# Altium schematic sheet Sheet1.SchDoc
size A; Author: Michael Chen; CompanyName: Pi-ooners; DrawnBy: Michael Chen; Engineer: Michael Chen; Organization: Pi-ooners; SheetNumber: 1; SheetTotal: 1
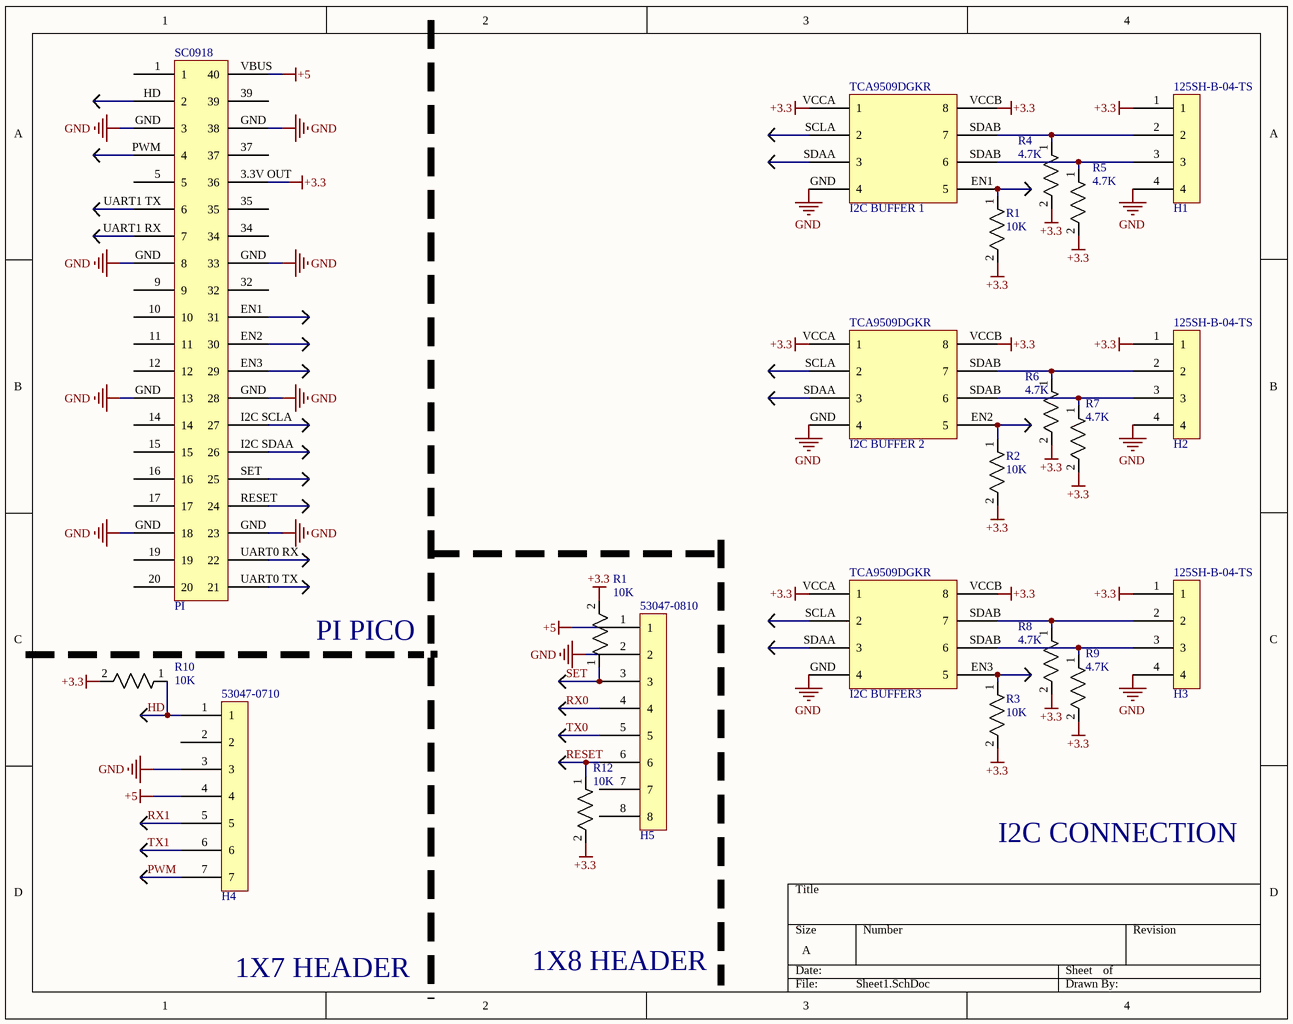
[diagram p0: Sheet1.SchDoc]

## Parts
(Parts that share a designator on the sheet are numbered #1, #2 ... from top to bottom, then left to right.)
125SH-B-04-TS#1  H1
125SH-B-04-TS#2  H2
125SH-B-04-TS#3  H3
53047-0710  H4
53047-0810  H5
R1#1  10K  [RES_CRCW_0603]
R1#2  10K  [RES_CRCW_0603]
R2  10K  [RES_CRCW_0603]
R3  10K  [RES_CRCW_0603]
R4  4.7K
R5  4.7K
R6  4.7K
R7  4.7K
R8  4.7K
R9  4.7K
R10  10K  [RES_CRCW_0603]
R12  10K  [RES_CRCW_0603]
SC0918  PI
TCA9509DGKR#1  I2C BUFFER 1
TCA9509DGKR#2  I2C BUFFER 2
TCA9509DGKR#3  I2C BUFFER3

## Nets
+3.3: 125SH-B-04-TS#1.1 125SH-B-04-TS#2.1 125SH-B-04-TS#3.1 R1#1.2 R1#2.2 R2.2 R3.2 R4.2 R5.2 R6.2 R7.2 R8.2 R9.2 R10.2 R12.2 SC0918.3.3V_OUT(36) TCA9509DGKR#1.VCCA(1) TCA9509DGKR#1.VCCB(8) TCA9509DGKR#2.VCCA(1) TCA9509DGKR#2.VCCB(8) TCA9509DGKR#3.VCCA(1) TCA9509DGKR#3.VCCB(8)
+5: 53047-0710.4 53047-0810.1 SC0918.VBUS(40)
GND: 125SH-B-04-TS#1.4 125SH-B-04-TS#2.4 125SH-B-04-TS#3.4 53047-0710.3 53047-0810.2 SC0918.GND(3) TCA9509DGKR#1.GND(4) TCA9509DGKR#2.GND(4) TCA9509DGKR#3.GND(4)
HD: 53047-0710.1 R10.1
PWM: 53047-0710.7
RESET: 53047-0810.6 R12.1
RX0: 53047-0810.4
RX1: 53047-0710.5
SET: 53047-0810.3 R1#2.1
TX0: 53047-0810.5
TX1: 53047-0710.6
Net125SH-B-04-TS#1_2: 125SH-B-04-TS#1.2 R4.1 TCA9509DGKR#1.SDAB(7)
Net125SH-B-04-TS#1_3: 125SH-B-04-TS#1.3 R5.1 TCA9509DGKR#1.SDAB(6)
Net125SH-B-04-TS#2_2: 125SH-B-04-TS#2.2 R6.1 TCA9509DGKR#2.SDAB(7)
Net125SH-B-04-TS#2_3: 125SH-B-04-TS#2.3 R7.1 TCA9509DGKR#2.SDAB(6)
Net125SH-B-04-TS#3_2: 125SH-B-04-TS#3.2 R8.1 TCA9509DGKR#3.SDAB(7)
Net125SH-B-04-TS#3_3: 125SH-B-04-TS#3.3 R9.1 TCA9509DGKR#3.SDAB(6)
NetR1#1_1: R1#1.1 TCA9509DGKR#1.EN(5)
NetR2_1: R2.1 TCA9509DGKR#2.EN(5)
NetR3_1: R3.1 TCA9509DGKR#3.EN(5)

Not connected (* = marked no-connect by the designer): 53047-0710 2; 53047-0810 7 8; SC0918 1 5 9 10 11 12 14 15 16 17 19 20 32 34 35 37 39 EN1(31) EN2(30) EN3(29) HD(2) I2C SCLA(27) I2C SDAA(26) PWM(4) RESET(24) SET(25) UART0 RX(22) UART0 TX(21) UART1 RX(7) UART1 TX(6); TCA9509DGKR#1 SCLA(2) SDAA(3); TCA9509DGKR#2 SCLA(2) SDAA(3); TCA9509DGKR#3 SCLA(2) SDAA(3)

## Notes on the sheet
- EN1
- (near TCA9509DGKR#2) EN2
- PI PICO
- EN3
- I2C CONNECTION
- 1X8 HEADER
- 1X7 HEADER

## Library data of the parts
125SH-B-04-TS#1-125SH-B-04-TS#3 = 1X4: Conn Shrouded Header (4 Sides) PL 4 POS 1.25mm Solder ST Top Entry Thru-Hole; Manufacturer: Adam Equipment; Manufacturer Part Number: 125SH-B-04-TS; Supplier: Digikey; Supplier Part Number: 2057-125SH-B-04-TS-ND; RoHS: No; Category: Connectors; Stock: 2581; ComponentLink1URL: http://datasheet.octopart.com/125SH-B-04-TS-Adam-Tech-datasheet-110600541.pdf?src-supplier=Digikey; ComponentLink1Description: http://datasheet.octopart.com/125SH-B-04-TS-Adam-Tech-datasheet-110600541.pdf?src-supplier=Digikey; ComponentLink2URL: http://datasheet.octopart.com/125SH-B-04-TS-Adam-Tech-datasheet-110600541.pdf?src-supplier=Allied+Electronics; ComponentLink2Description: http://datasheet.octopart.com/125SH-B-04-TS-Adam-Tech-datasheet-110600541.pdf?src-supplier=Allied+Electronics; ComponentLink3URL: http://datasheet.octopart.com/125SH-B-04-TS-Adam-Tech-datasheet-110600541.pdf?src-supplier=Arrow+Electronics; ComponentLink3Description: http://datasheet.octopart.com/125SH-B-04-TS-Adam-Tech-datasheet-110600541.pdf?src-supplier=Arrow+Electronics; ComponentLink4URL: http://datasheet.octopart.com/125SH-B-04-TS-Adam-Tech-datasheet-110600541.pdf?src-supplier=Verical; ComponentLink4Description: http://datasheet.octopart.com/125SH-B-04-TS-Adam-Tech-datasheet-110600541.pdf?src-supplier=Verical; ComponentLink5URL: http://datasheet.octopart.com/125SH-B-04-TS-Adam-Tech-datasheet-110600541.pdf?src-supplier=TME; ComponentLink5Description: http://datasheet.octopart.com/125SH-B-04-TS-Adam-Tech-datasheet-110600541.pdf?src-supplier=TME
53047-0710 = 1X7: Board Connector, 7 Contact(s), 1 Row(s), Male, Straight, 0.049 inch Pitch, Solder Terminal, Locking, White Insulator, Receptacle; Manufacturer: Molex; Manufacturer Part Number: 53047-0710; Manufacturer Series: 53047; Option: General Purpose; Contact Pattern: RECTANGULAR; Contact Style: Blade Pin; Filter Feature: No; Mating Information: MULTIPLE MATING PARTS AVAILABLE; Number Of Connectors: 1; Polarization Key: POLARIZED HOUSING; Number of Contacts: 7; Body Breadth: 0.126inch; Body Depth: 0.165inch; Body Length: 0.413inch; Reference Standard: UL; Reliability: COMMERCIAL; Supplier: Arrow Electronics; Supplier Part Number: 53047-0710; RoHS: Yes; Category: Headers and Wire Housings; Stock: 529; Mounting Technology: Board; Contact Material: Bronze; Contact Finish - Mating: TIN; Contact Finish - Termination: TIN; Insulation Color: White; Insulation Material: Nylon; Connector Type: BOARD CONNECTOR; JESD-609 Code: e3; Body/Shell Style: RECEPTACLE; Contact Gender: Male; Mixed Contacts: No; Mounting Style: STRAIGHT; Number Of PCB Rows: 1; Number of Rows Loaded: 1; PCB Contact Pattern: RECTANGULAR; Termination: Solder; Mating Contact Pitch: 0.049inch; Mounting Option 1: LOCKING; Terminal Length: 0.09inch; Terminal Pitch: 1.25mm; Flammability Rating: UL94 V-0; Reach SVHC Compliant: Yes; RoHS Compliant: Yes; DIN Conformance: No; IEC Conformance: No; MIL Conformance: No; ComponentLink1URL: https://datasheet.ciiva.com:443/pdfs/VipMasterIC/IC/MOLE/MOLES14431/MOLES14431-1.pdf?src-supplier=IHS+Markit; ComponentLink1Description: https://datasheet.ciiva.com:443/pdfs/VipMasterIC/IC/MOLE/MOLES14431/MOLES14431-1.pdf?src-supplier=IHS+Markit; ComponentLink2URL: https://datasheet.ciiva.com/11747/0900766b800a8aab-11747114.pdf?src-supplier=Rs; ComponentLink2Description: https://datasheet.ciiva.com/11747/0900766b800a8aab-11747114.pdf?src-supplier=Rs
53047-0810 = 1X8: Board Connector, 8 Contact(s), 1 Row(s), Male, Straight, 0.049 inch Pitch, Solder Terminal, Locking, White Insulator, Receptacle; Manufacturer: Molex; Manufacturer Part Number: 53047-0810; Option: General Purpose; Contact Pattern: RECTANGULAR; Contact Style: Blade Pin; Filter Feature: No; Mating Information: MULTIPLE MATING PARTS AVAILABLE; Number Of Connectors: 1; Polarization Key: POLARIZED HOUSING; Number of Contacts: 8; Body Breadth: 0.126inch; Body Depth: 0.165inch; Body Length: 0.463inch; Reference Standard: UL; Reliability: COMMERCIAL; Supplier: Arrow Electronics; Supplier Part Number: 53047-0810; RoHS: Yes; Category: Headers and Wire Housings; Stock: 9991; Mounting Technology: Board; Contact Material: Bronze; Contact Finish - Mating: TIN; Contact Finish - Termination: Tin (Sn); Insulation Color: White; Insulation Material: Nylon; Connector Type: BOARD CONNECTOR; JESD-609 Code: e3; Body/Shell Style: RECEPTACLE; Contact Gender: Male; Mixed Contacts: No; Mounting Style: STRAIGHT; Number Of PCB Rows: 1; Number of Rows Loaded: 1; PCB Contact Pattern: RECTANGULAR; Termination: Solder; Mating Contact Pitch: 0.049inch; Mounting Option 1: LOCKING; Terminal Length: 0.09inch; Terminal Pitch: 1.25mm; Flammability Rating: UL94 V-0; DIN Conformance: No; IEC Conformance: No; MIL Conformance: No; Reach SVHC Compliant: Yes; RoHS Compliant: Yes; ComponentLink1URL: https://datasheet.ciiva.com:443/pdfs/VipMasterIC/IC/MOLE/MOLES57524/MOLES57524-1.pdf?src-supplier=IHS+Markit; ComponentLink1Description: https://datasheet.ciiva.com:443/pdfs/VipMasterIC/IC/MOLE/MOLES57524/MOLES57524-1.pdf?src-supplier=IHS+Markit; ComponentLink2URL: https://datasheet.ciiva.com/3936/244840530470810-pcb-headers-3936043.pdf?src-supplier=Arrow+Electronics; ComponentLink2Description: https://datasheet.ciiva.com/3936/244840530470810-pcb-headers-3936043.pdf?src-supplier=Arrow+Electronics; ComponentLink3URL: https://datasheet.ciiva.com/34303/1932504-34303339.pdf?src-supplier=Jameco; ComponentLink3Description: https://datasheet.ciiva.com/34303/1932504-34303339.pdf?src-supplier=Jameco; ComponentLink4URL: https://datasheet.ciiva.com/11747/0900766b8024e2fd-11747012.pdf?src-supplier=Rs; ComponentLink4Description: https://datasheet.ciiva.com/11747/0900766b8024e2fd-11747012.pdf?src-supplier=Rs; ComponentLink5URL: https://datasheet.ciiva.com/25291/1815828-25291355.pdf?src-supplier=Newark; ComponentLink5Description: https://datasheet.ciiva.com/25291/1815828-25291355.pdf?src-supplier=Newark; ComponentLink6URL: https://datasheet.ciiva.com/14156/ge116819-116832-e-14156239.pdf?src-supplier=Distrelec; ComponentLink6Description: https://datasheet.ciiva.com/14156/ge116819-116832-e-14156239.pdf?src-supplier=Distrelec
R1#1 R1#2 R2 R3 R10 R12 = 10K Resistor: Fixed Resistor, Metal Glaze/thick Film, 0.1W, 10000ohm, 75V, 1% +/-Tol, 100ppm/Cel, Surface Mount, 0603; Mfr_Name: Vishay; Manufacturer Part Number: CRCW060310K0FKEA; Power: 100mW; Value: 10kR; Temperature Coefficient (ppm/Cel): 100; Rated Temperature: 70°C; Package Height: 0.45mm; Package Length: 1.55mm; Package Width: 0.85mm; Reference Standard: AEC-Q200; Supplier: Arrow Electronics; Supplier Part Number: CRCW060310K0FKEA; Manufacturer: Vishay; RoHS: Yes; Category: Chip SMD Resistors; Stock: 42770000; Mounting Technology: Surface Mount; Pins: 2; Case/Package: 0603; Terminal Finish: Nickel; Package Shape: Rectangular; Min Operating Temperature: -55°C; Max Operating Temperature: 155°C; Tolerance: 1%; JESD-609 Code: e3; Resistor Type: FIXED RESISTOR; Construction: Chip; Packaging: Tape and Reel; Technology: METAL GLAZE/THICK FILM; Working Voltage: 75V; Termination: Wraparound; Reach SVHC Compliant: Yes; RoHS Compliant: Yes; ComponentLink1URL: https://datasheet.ciiva.com:443/pdfs/VipMasterIC/IC/VISH/VISH-S-A0007266705/VISH-S-A0007266705-1.pdf?src-supplier=IHS+Markit; ComponentLink1Description: https://datasheet.ciiva.com:443/pdfs/VipMasterIC/IC/VISH/VISH-S-A0007266705/VISH-S-A0007266705-1.pdf?src-supplier=IHS+Markit; ComponentLink2URL: https://datasheet.ciiva.com/11809/0900766b80d98afc-11809037.pdf?src-supplier=Rs; ComponentLink2Description: https://datasheet.ciiva.com/11809/0900766b80d98afc-11809037.pdf?src-supplier=Rs; ComponentLink3URL: https://datasheet.ciiva.com/46385/1697337-46385498.pdf?src-supplier=Element14; ComponentLink3Description: https://datasheet.ciiva.com/46385/1697337-46385498.pdf?src-supplier=Element14; ComponentLink4URL: https://datasheet.ciiva.com/5543/dcrcwe3-109170-5543001.pdf?src-supplier=Mouser; ComponentLink4Description: https://datasheet.ciiva.com/5543/dcrcwe3-109170-5543001.pdf?src-supplier=Mouser; ComponentLink5URL: https://datasheet.ciiva.com/26314/fld-crcw-e3-data-en-26314749.pdf?src-supplier=Distrelec; ComponentLink5Description: https://datasheet.ciiva.com/26314/fld-crcw-e3-data-en-26314749.pdf?src-supplier=Distrelec; ComponentLink6URL: https://datasheet.ciiva.com/3256/dcrcwe3-3256939.pdf?src-supplier=Avnet; ComponentLink6Description: https://datasheet.ciiva.com/3256/dcrcwe3-3256939.pdf?src-supplier=Avnet; ComponentLink7URL: https://datasheet.ciiva.com/3256/dcrcwe3-3256940.pdf?src-supplier=Avnet; ComponentLink7Description: https://datasheet.ciiva.com/3256/dcrcwe3-3256940.pdf?src-supplier=Avnet; ComponentLink8URL: https://datasheet.ciiva.com/2465/dcrcwe3-2465513.pdf?src-supplier=Digikey; ComponentLink8Description: https://datasheet.ciiva.com/2465/dcrcwe3-2465513.pdf?src-supplier=Digikey; ComponentLink9URL: https://datasheet.ciiva.com/2465/dcrcwe3-2465514.pdf?src-supplier=Digikey; ComponentLink9Description: https://datasheet.ciiva.com/2465/dcrcwe3-2465514.pdf?src-supplier=Digikey; ComponentLink10URL: https://datasheet.ciiva.com/2465/dcrcwe3-2465515.pdf?src-supplier=Digikey; ComponentLink10Description: https://datasheet.ciiva.com/2465/dcrcwe3-2465515.pdf?src-supplier=Digikey; ComponentLink11URL: https://datasheet.ciiva.com/16209/dcrcwe3-16209164.pdf?src-supplier=Future+Electronics; ComponentLink11Description: https://datasheet.ciiva.com/16209/dcrcwe3-16209164.pdf?src-supplier=Future+Electronics; ComponentLink12URL: https://datasheet.ciiva.com/16719/70201119-16719704.pdf?src-supplier=Allied+Electronics; ComponentLink12Description: https://datasheet.ciiva.com/16719/70201119-16719704.pdf?src-supplier=Allied+Electronics; ComponentLink13URL: https://datasheet.ciiva.com/16754/70201119-16754710.pdf?src-supplier=Allied+Electronics; ComponentLink13Description: https://datasheet.ciiva.com/16754/70201119-16754710.pdf?src-supplier=Allied+Electronics; ComponentLink14URL: https://datasheet.ciiva.com/26821/getdatasheetpartid-86831-26821109.pdf?src-supplier=Verical; ComponentLink14Description: https://datasheet.ciiva.com/26821/getdatasheetpartid-86831-26821109.pdf?src-supplier=Verical
R4-R9 = PULL UP RESISTOR: Fixed Resistor, Metal Glaze/thick Film, 0.063W, 4700ohm, 50V, 1% +/-Tol, 100ppm/Cel, Surface Mount, 0402; Manufacturer: Vishay; Manufacturer Part Number: CRCW04024K70FKED; Power: 63mW; Value: 4.7kR; Temperature Coefficient (ppm/Cel): 100; Rated Temperature: 70°C; Package Height: 0.35mm; Package Length: 1mm; Package Width: 0.5mm; Reference Standard: AEC-Q200; Supplier: Arrow Electronics; Supplier Part Number: CRCW04024K70FKED; RoHS: Yes; Category: Chip SMD Resistors; Stock: 9060000; Mounting Technology: Surface Mount; Pins: 2; Terminal Finish: Nickel; Package Shape: Rectangular; Case/Package: 0402; Min Operating Temperature: -55°C; Max Operating Temperature: 155°C; Tolerance: 1%; JESD-609 Code: e3; Resistor Type: FIXED RESISTOR; Construction: Chip; Packaging: Tape and Reel; Technology: METAL GLAZE/THICK FILM; Working Voltage: 50V; Termination: Wraparound; Reach SVHC Compliant: Yes; RoHS Compliant: Yes; ComponentLink1URL: https://datasheet.ciiva.com:443/pdfs/VipMasterIC/IC/VISH/VISH-S-A0007266705/VISH-S-A0007266705-1.pdf?src-supplier=IHS+Markit; ComponentLink1Description: https://datasheet.ciiva.com:443/pdfs/VipMasterIC/IC/VISH/VISH-S-A0007266705/VISH-S-A0007266705-1.pdf?src-supplier=IHS+Markit; ComponentLink2URL: https://datasheet.ciiva.com/2463/dcrcwe3-2463034.pdf?src-supplier=Digikey; ComponentLink2Description: https://datasheet.ciiva.com/2463/dcrcwe3-2463034.pdf?src-supplier=Digikey; ComponentLink3URL: https://datasheet.ciiva.com/2463/dcrcwe3-2463035.pdf?src-supplier=Digikey; ComponentLink3Description: https://datasheet.ciiva.com/2463/dcrcwe3-2463035.pdf?src-supplier=Digikey; ComponentLink4URL: https://datasheet.ciiva.com/2463/dcrcwe3-2463036.pdf?src-supplier=Digikey; ComponentLink4Description: https://datasheet.ciiva.com/2463/dcrcwe3-2463036.pdf?src-supplier=Digikey; ComponentLink5URL: https://datasheet.ciiva.com/16764/70201119-16764281.pdf?src-supplier=Allied+Electronics; ComponentLink5Description: https://datasheet.ciiva.com/16764/70201119-16764281.pdf?src-supplier=Allied+Electronics
SC0918 = PI: Raspberry Pi Pico W RP2040; Manufacturer Part Number: SC0918; Supplier: Digikey; Supplier Part Number: 2648-SC0918CT-ND; Manufacturer: Raspberry Pi; RoHS: No; Stock: 2771
TCA9509DGKR#1-TCA9509DGKR#3 = I2C BUFFER: Interface Circuit, PDSO8; Manufacturer: Texas Instruments; Manufacturer Part Number: TCA9509DGKR; Package Body Material: Plastic; Channels: 1; Package Equivalence Code: TSSOP8,.19; Power Supplies: 3/5V; Max Supply Voltage: 5.5V; Min Supply Voltage: 2.7V; Qualification Status: Not Qualified; Supplier: Mouser; Supplier Part Number: 595-TCA9509DGKR; RoHS: Yes; Category: Interface ICs; Stock: 44404; Case/Package: TSSOP; Pins: 8; Package Shape: Square; Terminal Finish: Gold; Min Operating Temperature: -40°C; Max Operating Temperature: 85°C; JESD-609 Code: e4; Interface IC Type: INTERFACE CIRCUIT; JESD-30 Code: S-PDSO-G8; Moisture Sensitivity Level: 1; Package Style: SMALL OUTLINE, THIN PROFILE, SHRINK PITCHMeter; Peak Reflow Temperature (Cel): 260°C; Surface Mount: Yes; Terminal Form: Gull Wing; Terminal Position: DUAL; Length: 3mm; Width: 3mm; Height - Seated (Max): 1.1mm; Terminal Pitch: 0.65mm; Temperature Grade: INDUSTRIAL; Reach SVHC Compliant: Yes; RoHS Compliant: Yes; ComponentLink1URL: https://www.ti.com:443/lit/ds/symlink/tca9509.pdf?src-supplier=IHS+Markit; ComponentLink1Description: https://www.ti.com:443/lit/ds/symlink/tca9509.pdf?src-supplier=IHS+Markit; ComponentLink2URL: https://datasheet.ciiva.com/22791/tca9509-22791264.pdf?src-supplier=Farnell; ComponentLink2Description: https://datasheet.ciiva.com/22791/tca9509-22791264.pdf?src-supplier=Farnell; ComponentLink3URL: https://datasheet.ciiva.com/3149/tca9509-3149522.pdf?src-supplier=Avnet; ComponentLink3Description: https://datasheet.ciiva.com/3149/tca9509-3149522.pdf?src-supplier=Avnet; ComponentLink4URL: https://datasheet.ciiva.com/26911/getdatasheetpartid-476504-26911504.pdf?src-supplier=Verical; ComponentLink4Description: https://datasheet.ciiva.com/26911/getdatasheetpartid-476504-26911504.pdf?src-supplier=Verical; ComponentLink5URL: https://datasheet.ciiva.com/41460/001187989-da-01-en-ic-i2c-bus-rep-l-tca9509dgkr-vssop-8-tid-41460370.pdf?src-supplier=Conrad; ComponentLink5Description: https://datasheet.ciiva.com/41460/001187989-da-01-en-ic-i2c-bus-rep-l-tca9509dgkr-vssop-8-tid-41460370.pdf?src-supplier=Conrad; ComponentLink6URL: https://datasheet.ciiva.com/1784/tca9509-1784225.pdf?src-supplier=Digikey; ComponentLink6Description: https://datasheet.ciiva.com/1784/tca9509-1784225.pdf?src-supplier=Digikey; ComponentLink7URL: https://datasheet.ciiva.com/1784/tca9509-1784226.pdf?src-supplier=Digikey; ComponentLink7Description: https://datasheet.ciiva.com/1784/tca9509-1784226.pdf?src-supplier=Digikey; ComponentLink8URL: https://datasheet.ciiva.com/1784/tca9509-1784227.pdf?src-supplier=Digikey; ComponentLink8Description: https://datasheet.ciiva.com/1784/tca9509-1784227.pdf?src-supplier=Digikey